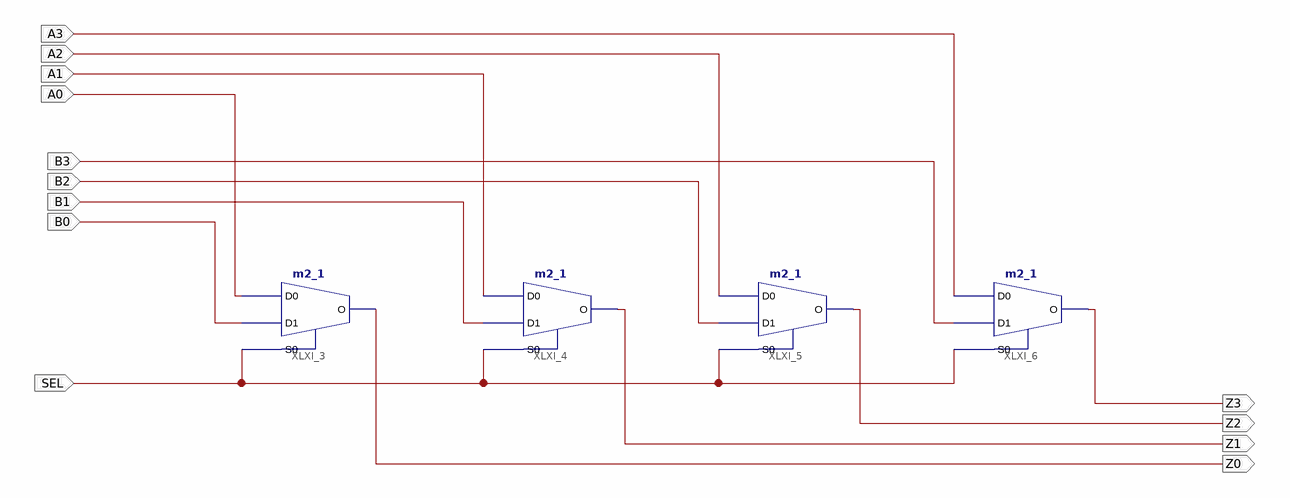
[diagram p0: schematic sheet 1]
// Xilinx ISE schematic MUX4_2_1.sch (spartan3) as structural Verilog: 4 symbols, 13 ports
module MUX4_2_1 (
  input  A0,
  input  A1,
  input  A2,
  input  A3,
  input  SEL,
  input  B0,
  input  B1,
  input  B2,
  input  B3,
  output Z2,
  output Z3,
  output Z1,
  output Z0
);

  m2_1 XLXI_3 (.D0(A0), .D1(B0), .S0(SEL), .O(Z0));
  m2_1 XLXI_4 (.D0(A1), .D1(B1), .S0(SEL), .O(Z1));
  m2_1 XLXI_5 (.D0(A2), .D1(B2), .S0(SEL), .O(Z2));
  m2_1 XLXI_6 (.D0(A3), .D1(B3), .S0(SEL), .O(Z3));
endmodule
